# EAGLE design TRV2_0 (EAGLE 7.6.0)
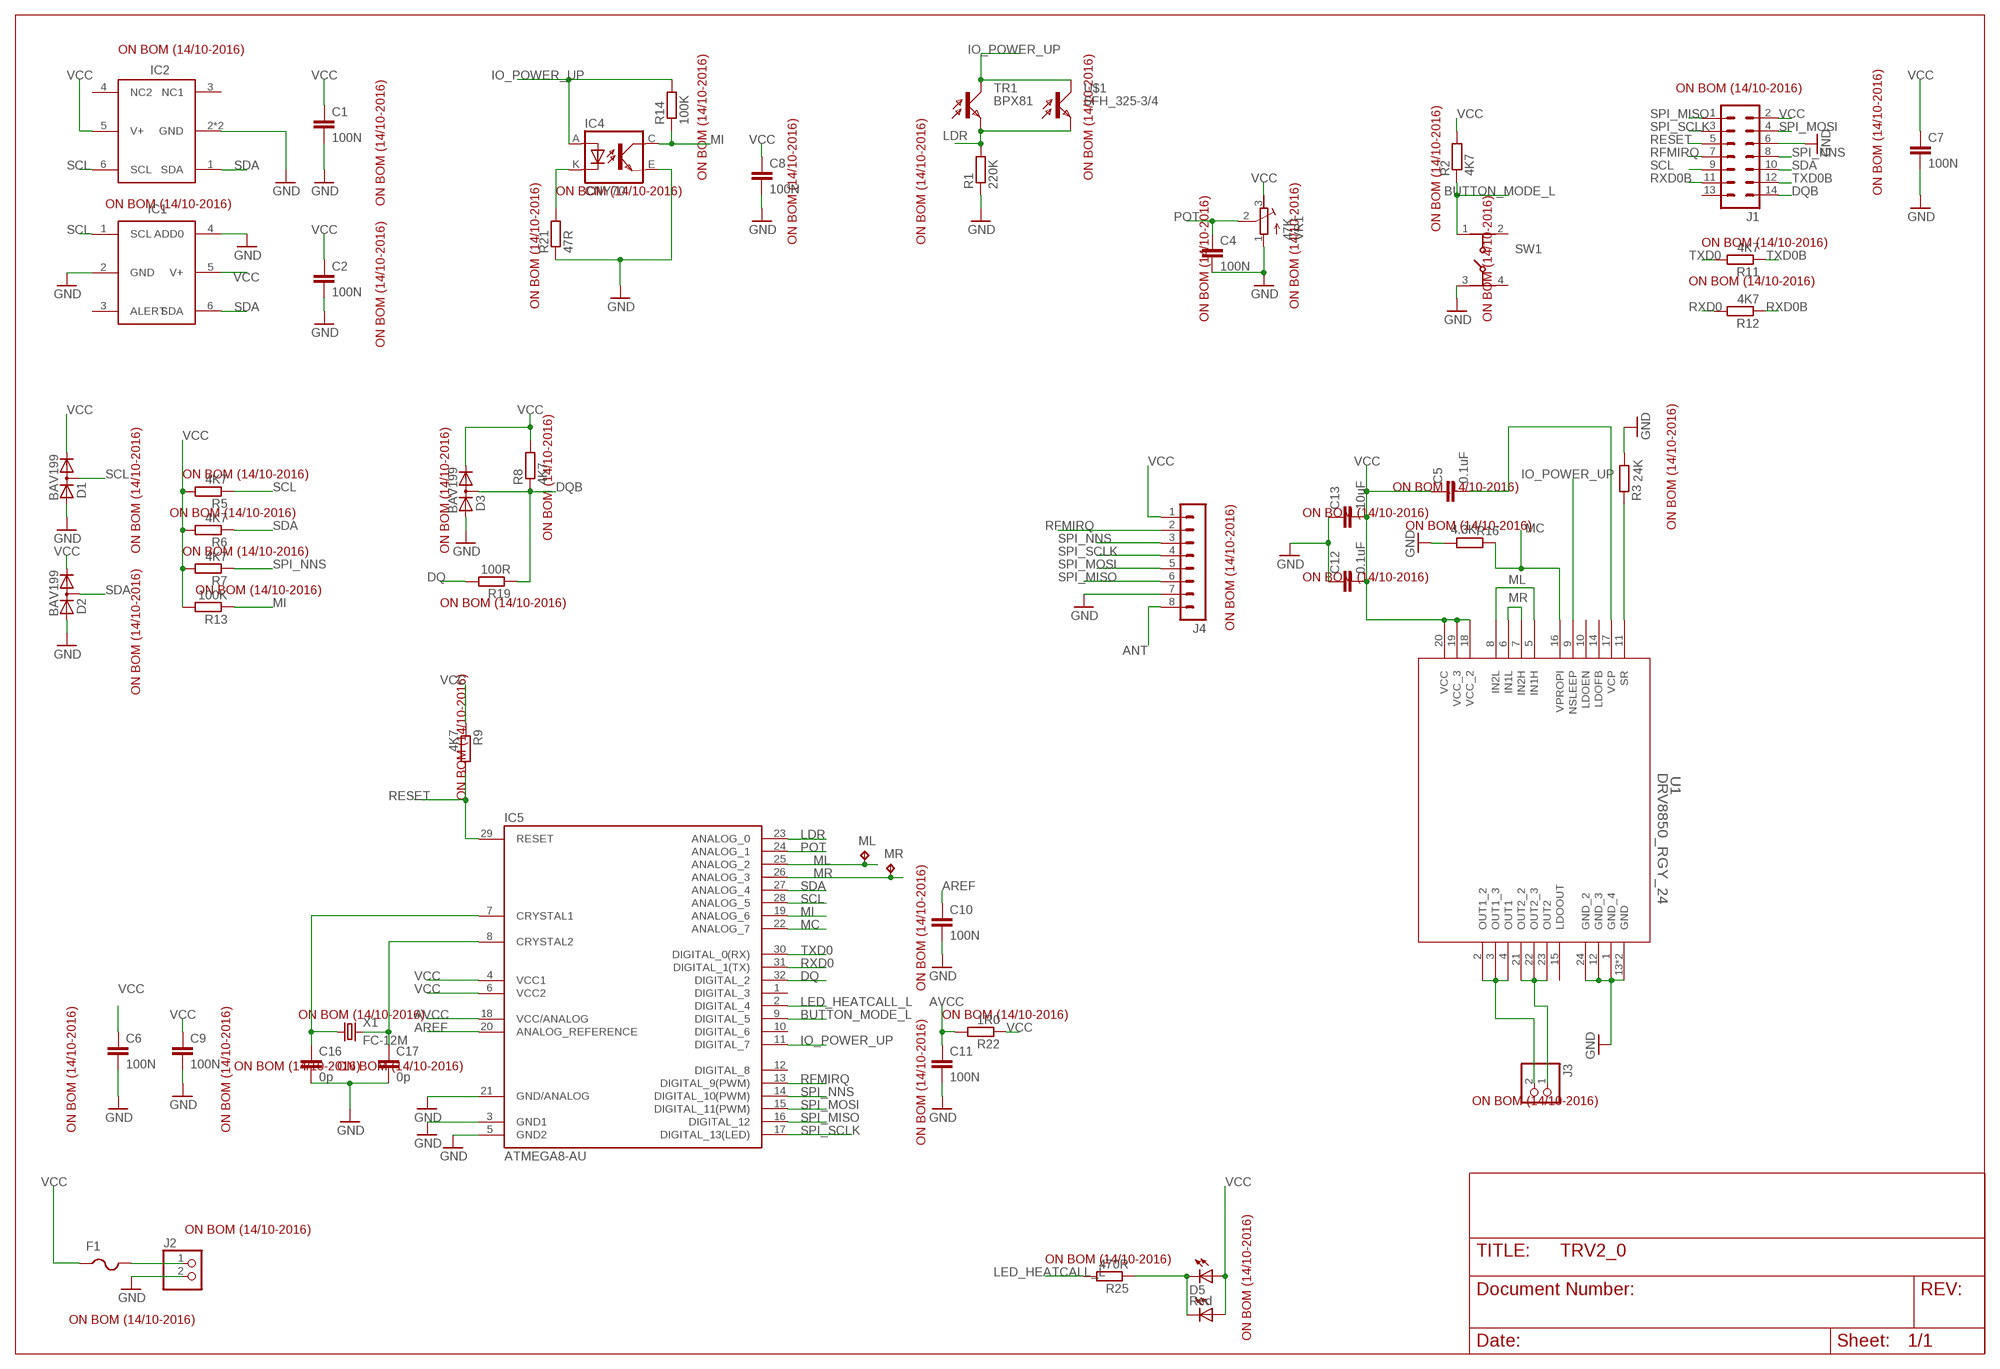
[diagram p0: schematic, sheet 1]

## Parts
C1  100N  C-EUC0603  [C0603]
C2  100N  C-EUC0603  [C0603]
C4  100N  C-EUC0603  [C0603]
C5  0.1uF  C-EUC0603  [C0603]
C6  100N  C-EUC0603  [C0603]
C7  100N  C-EUC0603  [C0603]
C8  100N  C-EUC0603  [C0603]
C9  100N  C-EUC0603  [C0603]
C10  100N  C-EUC0603  [C0603]
C11  100N  C-EUC0603  [C0603]
C12  0.1uF  C-EUC0603  [C0603]
C13  10uF  C-EUC0603  [C0603]
C16  0p  C-EUC0603  [C0603]
C17  0p  C-EUC0603  [C0603]
D1  BAV199  [SOT23]
D2  BAV199  [SOT23]
D3  BAV199  [SOT23]
D5  Red  LED3MM  [LED3MM]
F1  PTCFUSE-0603  [CHIPLED-0603-TTW]
IC1  TMP112  [TMP112]
IC2  IC2  SHT21  [SHT21]
IC4  CNY70  [4]
IC5  ATMEGA8-AU  [TQFP32-08]
J1  MA07-2  [MA07-2]
J2  PINHD-1X2  [1X02]
J3  PINHD-1X2  [1X02]
J4  MA08-1  [MA08-1]
ML  TPB1,27  [B1,27]
MR  TPB1,27  [B1,27]
R1  220K  R-EU_R0603  [R0603]
R2  4K7  R-EU_R0603  [R0603]
R3  24K  R-EU_R0603  [R0603]
R5  4K7  R-EU_R0603  [R0603]
R6  4K7  R-EU_R0603  [R0603]
R7  4K7  R-EU_R0603  [R0603]
R8  4K7  R-EU_R0603  [R0603]
R9  4K7  R-EU_R0603  [R0603]
R11  4K7  R-EU_R0603  [R0603]
R12  4K7  R-EU_R0603  [R0603]
R13  100K  R-EU_R0603  [R0603]
R14  100K  R-EU_R0603  [R0603]
R16  4.3K  R-EU_R0603  [R0603]
R19  100R  R-EU_R0603  [R0603]
R21  47R  R-EU_R0603  [R0603]
R22  1R0  R-EU_R0603  [R0603]
R25  470R  R-EU_R0603  [R0603]
SW1  434331013822  [434331013822]
TR1  BPX81  [BPX81]
U1  DRV8850_RGY_24  [RGY_24]
U$1  SFH_325-3/4  [SFH_325-3/4]
U$2  KINGBRIGHTSIDELED  [KINGBRIGHTSIDELED]
VR1  47K  R-TRIMM3296W  [RTRIM3296W]
X1  FC-12M  [FC-12M]

## Nets
ANT: J4.8
AREF: C10.1 IC5.20(ANALOG_REFERENCE)
AVCC: C11.1 IC5.18(VCC/ANALOG) R22.2
BUTTON_MODE_L: IC5.9(DIGITAL_5) R2.1 SW1.1
DQ: IC5.32(DIGITAL_2) R19.2
DQB: D3.3(AC) J1.14 R8.1 R19.1
GND: C1.2 C2.2 C4.2 C6.2 C7.2 C8.2 C9.2 C10.2 C11.2 C12.1 C13.1 C16.2 C17.2 D1.1(A) D2.1(A) D3.1(A) IC1.2(GND) IC1.4(ADD0) IC2.2(GND) IC2.P$1(GND) IC4.E(EMI) IC5.3(GND1) IC5.5(GND2) IC5.21(GND/ANALOG) J1.6 J2.2 J4.7 R1.1 R3.1 R16.1 R21.1 SW1.3 U1.1(GND_4) U1.12(GND_3) U1.13(GND) U1.24(GND_2) U1.25(GND) VR1.1(A)
IO_POWER_UP: IC4.A IC5.11(DIGITAL_7) R14.2 TR1.C U1.9(NSLEEP) U$1.P$2(C)
LDR: IC5.23(ANALOG_0) R1.2 TR1.E U$1.P$1(E)
LED_HEATCALL_L: IC5.2(DIGITAL_4) R25.2
MC: IC5.22(ANALOG_7) R16.2 U1.16(VPROPI)
MI: IC4.C(COL) IC5.19(ANALOG_6) R13.1 R14.1
ML: IC5.25(ANALOG_2) ML.TP U1.5(IN1H) U1.8(IN2L)
MR: IC5.26(ANALOG_3) MR.TP U1.6(IN1L) U1.7(IN2H)
N$1: IC4.K(C) R21.2
N$2: J3.2 U1.2(OUT1_2) U1.3(OUT1_3) U1.4(OUT1)
N$4: C16.1 IC5.7(CRYSTAL1) X1.1
N$5: C17.1 IC5.8(CRYSTAL2) X1.2
N$7: D5.K(C) R25.1 U$2.C
N$8: F1.C J2.1
N$11: J3.1 U1.21(OUT2_2) U1.22(OUT2_3) U1.23(OUT2)
N$12: R3.2 U1.11(SR)
N$20: C5.2 U1.17(VCP)
POT: C4.1 IC5.24(ANALOG_1) VR1.2(S)
RESET: IC5.29(RESET) J1.5 R9.2
RFMIRQ: IC5.13(DIGITAL_9(PWM)) J1.7 J4.2
RXD0: IC5.31(DIGITAL_1(TX)) R12.2
RXD0B: J1.11 R12.1
SCL: D1.3(AC) IC1.1(SCL) IC2.6(SCL) IC5.28(ANALOG_5) J1.9 R5.1
SDA: D2.3(AC) IC1.6(SDA) IC2.1(SDA) IC5.27(ANALOG_4) J1.10 R6.1
SPI_MISO: IC5.16(DIGITAL_12) J1.1 J4.6
SPI_MOSI: IC5.15(DIGITAL_11(PWM)) J1.4 J4.5
SPI_NNS: IC5.14(DIGITAL_10(PWM)) J1.8 J4.3 R7.1
SPI_SCLK: IC5.17(DIGITAL_13(LED)) J1.3 J4.4
TXD0: IC5.30(DIGITAL_0(RX)) R11.2
TXD0B: J1.12 R11.1
VCC: C1.1 C2.1 C5.1 C6.1 C7.1 C8.1 C9.1 C12.2 C13.2 D1.2(C) D2.2(C) D3.2(C) D5.A F1.A IC1.5(V+) IC2.5(V+) IC5.4(VCC1) IC5.6(VCC2) J1.2 J4.1 R2.2 R5.2 R6.2 R7.2 R8.2 R9.1 R13.2 R22.1 U1.18(VCC_2) U1.19(VCC_3) U1.20(VCC) U$2.A VR1.3(E)
Unconnected: IC1.3(ALERT) IC2.3(NC1) IC2.4(NC2) IC5.1(DIGITAL_3) IC5.10(DIGITAL_6) IC5.12(DIGITAL_8) J1.13 SW1.2 SW1.4 U1.10(LDOEN) U1.14(LDOFB) U1.15(LDOOUT)

## Notes on the sheet
- ON BOM (14/10-2016) | ON BOM (14/10-2016) | ON BOM (14/10-2016)
- IC2
- ON BOM (14/10-2016)
- ON BOM (14/10-2016)
- ON BOM (14/10-2016)
- ON BOM (14/10-2016) | ON BOM (14/10-2016)
- ON BOM (14/10-2016) | ON BOM (14/10-2016)
- ON BOM (14/10-2016) | ON BOM (14/10-2016) | ON BOM (14/10-2016) | ON BOM (14/10-2016)
- ON BOM (14/10-2016)
- IC1
- ON BOM (14/10-2016)
- ON BOM (14/10-2016)
- ON BOM (14/10-2016)
- ON BOM (14/10-2016)
- ON BOM (14/10-2016) | ON BOM (14/10-2016)
- ON BOM (14/10-2016)
- ON BOM (14/10-2016)
- ON BOM (14/10-2016)
- ON BOM (14/10-2016) | ON BOM (14/10-2016)
- ON BOM (14/10-2016) | ON BOM (14/10-2016)
- ON BOM (14/10-2016)
- ON BOM (14/10-2016)
- ON BOM (14/10-2016)
- ON BOM (14/10-2016)
- ON BOM (14/10-2016)
- ON BOM (14/10-2016)
- ON BOM (14/10-2016)
- ON BOM (14/10-2016) | ON BOM (14/10-2016)
- ON BOM (14/10-2016) | ON BOM (14/10-2016) | ON BOM (14/10-2016)
- ON BOM (14/10-2016) | ON BOM (14/10-2016)
- ON BOM (14/10-2016)
- ON BOM (14/10-2016)
- ON BOM (14/10-2016)
- ON BOM (14/10-2016)
- ON BOM (14/10-2016)

## Library data of the parts
C1 C2 C4 C6-C11 C16 C17 = rcl:C-EU: CAPACITOR, European symbol
C5 C12 C13 = resistor:C-EU: CAPACITOR, European symbol
D1-D3 = diode:BAV199: DIODE low-leakage double diode
D5 = adafruit:LED: LED OSRAM: - CHIPLED LG R971, LG N971, LY N971, LG Q971, LY Q971, LO R971, LY R971 LH N974, LH R974 LS Q976, LO Q976, LY Q976 LO Q996 - Hyper CHIPLED LW Q18S LB Q993, LB Q99A, LB R99A - SideLED LS A670, LO A670, LY A670, LG A670, LP A670 LB A673, LV A673, LT A673, LW A673 LH A674 LY A675 LS A676, LA A676, LO A676, LY A676, LW A676 LS A679, LY A679, LG A679 - Hyper Micro SIDELED® LS Y876, LA Y876, LO Y876, LY Y876 LT Y87S - SmartLED LW L88C, LW L88S LB L89C, LB L89S, LG L890 LS L89K, LO L89K, LY L89K LS L896, LA L896, LO L896, LY L896 - TOPLED LS T670, LO T670, LY T670, LG T670, LP T670 LSG T670, LSP T670, LSY T670, LOP T670, LYG T670 LG T671, LOG T671, LSG T671 LB T673, LV T673, LT T673, LW T673 LH T674 LS T676, LA T676, LO T676, LY T676, LB T676, LH T676, LSB T676, LW T676 LB T67C, LV T67C, LT T67C, LS T67K, LO T67K, LY T67K, LW E67C LS E67B, LA E67B, LO E67B, LY E67B, LB E67C, LV E67C, LT E67C LW T67C LS T679, LY T679, LG T679 LS T770, LO T770, LY T770, LG T770, LP T770 LB T773, LV T773, LT T773, LW T773 LH T774 LS E675, LA E675, LY E675, LS T675 LS T776, LA T776, LO T776, LY T776, LB T776 LHGB T686 LT T68C, LB T68C - Hyper Mini TOPLED® LB M676 - Mini TOPLED Santana® LG M470 LS M47K, LO M47K, LY M47K Source: http://www.osram.convergy.de/
F1 = adafruit:PTCFUSE: PTC fuses, resettable thermistors
IC1 = TMP112:TMP112
IC2 = SHT21:SHT21: Tempsensor RS No: 709-8868 MRF No: TMP112AIDRLT
IC4 = cny70:CNY70
IC5 = Arduino-AVR:ATMEGA8
J1 = con-lstb:MA07-2: PIN HEADER; OC_FARNELL: unknown; OC_NEWARK: unknown
J2 J3 = pinhead:PINHD-1X2: PIN HEADER
J4 = con-lstb:MA08-1: PIN HEADER; OC_FARNELL: unknown; OC_NEWARK: unknown
ML MR = testpad:TP: Test pad
R1-R3 R5-R9 R11-R14 R16 R19 R21 R22 R25 = resistor:R-EU_: RESISTOR, European symbol
SW1 = EAGLE-TACT_SWITCHES-rev16e:434331013822: WS-TASU Side push Tact Switch, SMD version Specification Rating : 50mA, 12VDC Contact Resistance Initial: 100mΩ max. After life test:1mΩ max. Insulation Resistance: min.100MΩ at 500VDC Dielectric Strength : 250VAC for 1 minute Stroke:0.2+0.2/-0.1mm Bounce :10ms max. Material Cover : : Stainless steel Stem :PA46 UL HB. FramePA46 UL HB, color Black >Contact : Stainless Steel with Silver Tape:Polyimide tape Terminal : Copper Alloy with Silver <http://katalog.we-online.de/media/images/v2/Family_WS-TASU_434331013822_c.jpg> Details see: http://katalog.we-online.de/em/datasheet/434331013822.pdf 2015 (C) Würth Elektronik
TR1 = opto-trans-siemens:BPX81: PHOTO TRANSISTOR; OC_FARNELL: unknown; OC_NEWARK: unknown
U1 = drv8850:DRV8850_RGY_24; MANUFACTURER_PART_NUMBER: drv8850_rgy_24; VENDOR: Texas Instruments
U$1 = opto-trans-siemens:SFH_325-3/4
U$2 = led:KINGBRIGHTSIDELED
VR1 = resistor:R-TRIMM: Trimm resistor
X1 = crystal:FC-12M: kHz RANGE CRYSTAL UNIT LOW PROFILE SMD Source: Epson Toyocom FC-12M.pdf

## Net classes
0 default: width 0 mm

## Board
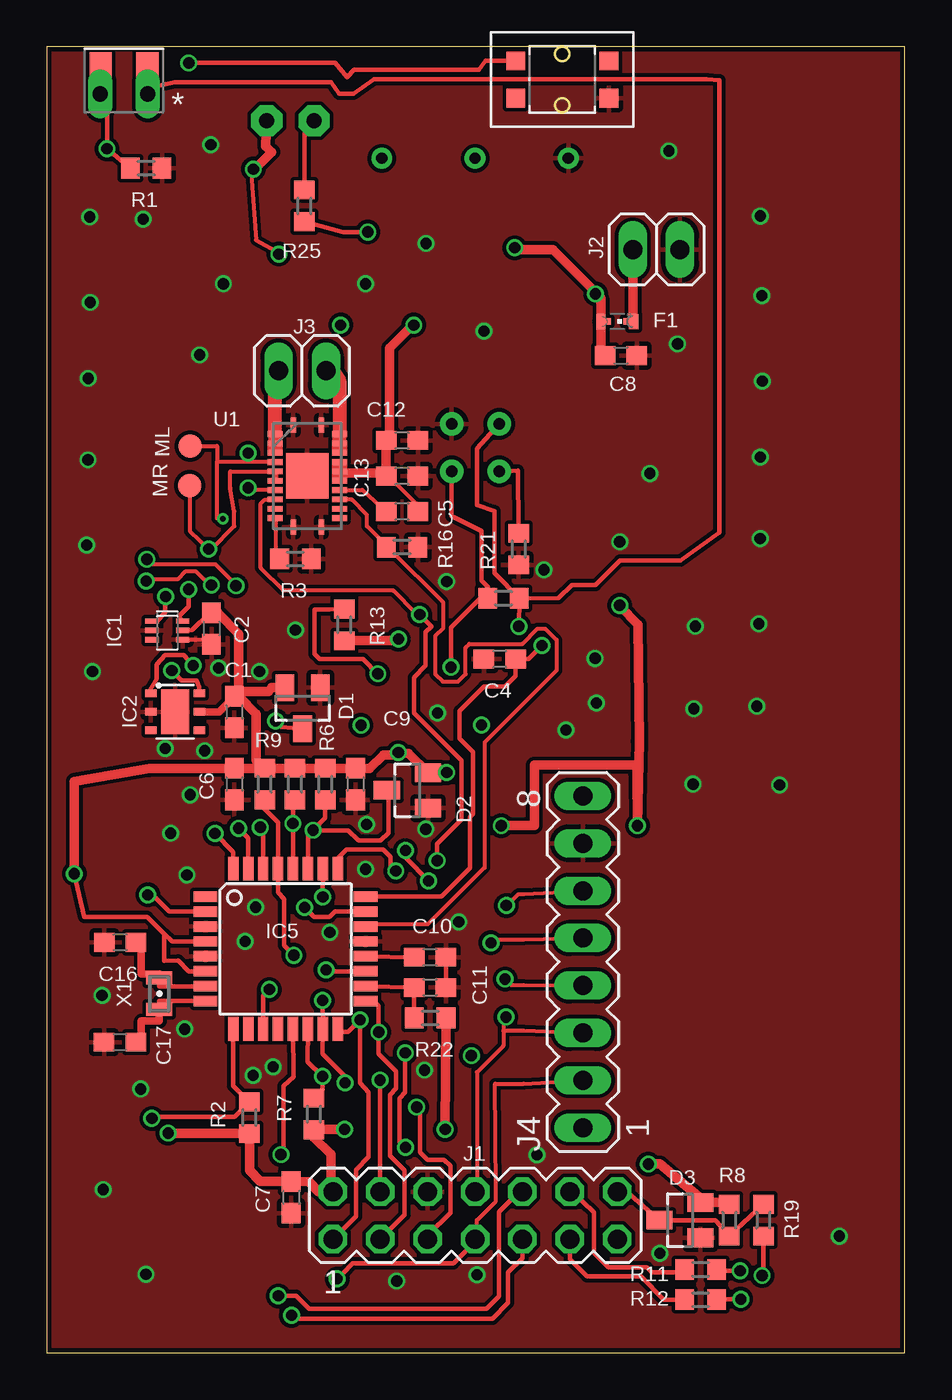
[diagram p1: board, top side]
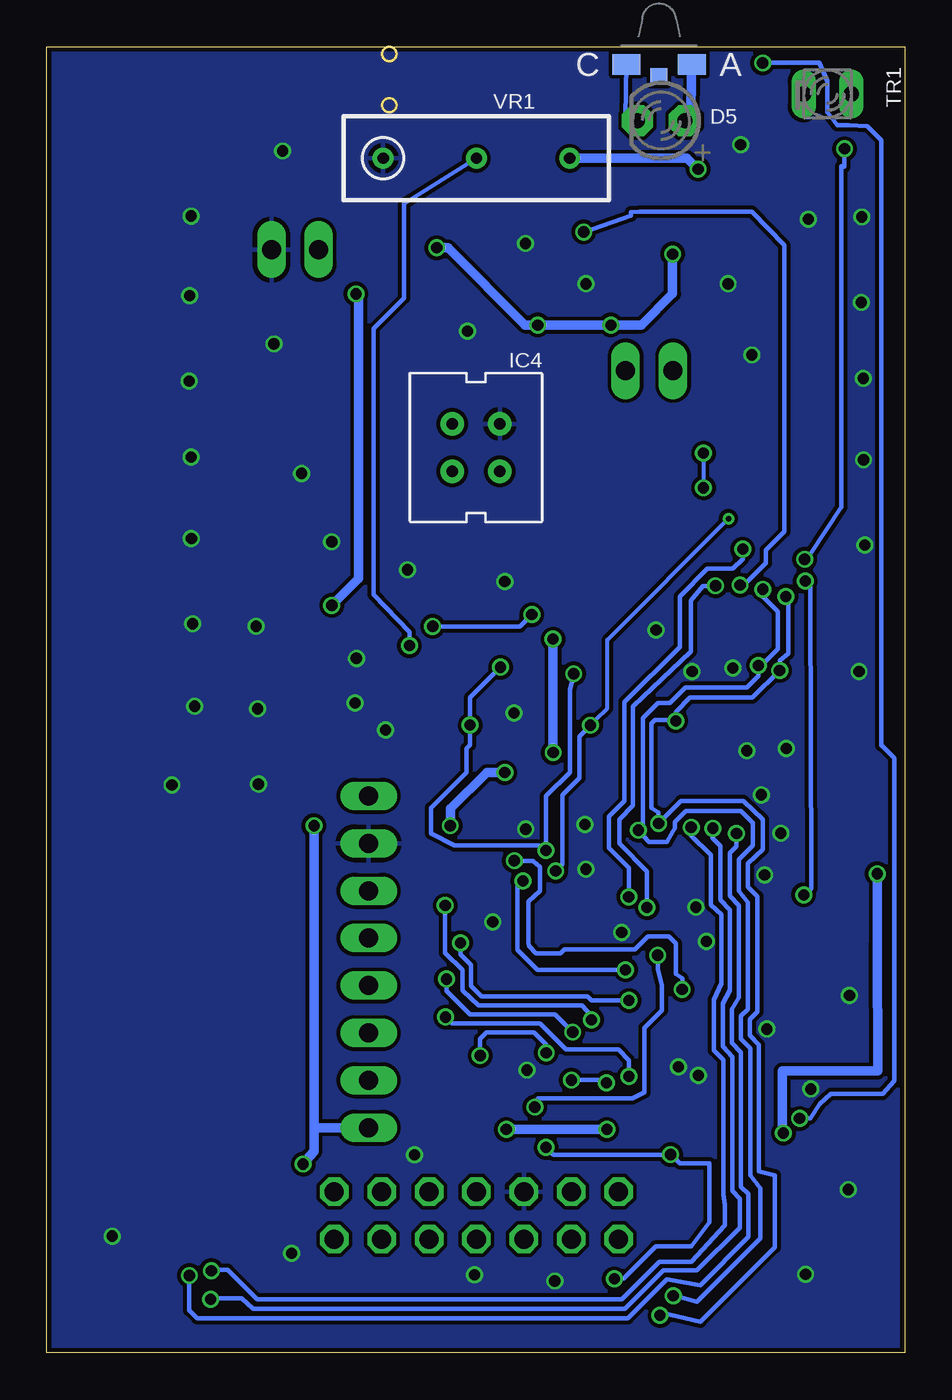
[diagram p2: board, bottom side, seen from below]

Size 46 x 70 mm. Coordinates in mm from the lower left corner, seen from the top.
Outline: 0,0 46,0 46,70 0,70 0,0
Copper layers (1*16): Top 0.035mm / dielectric 1.5mm / Bottom 0.035mm
Design rules "PMServicesStd": minimum track width 8mil, minimum drill 12mil, track to track 8mil, track to pad 8mil, pad to pad 8mil, via to via 8mil, smd to smd 0mil, copper to edge 10mil, drill to drill 10mil, minimum pad ring 10mil, minimum via ring 6mil, stop-mask expansion 2mil, vias tented up to drill 100mil, thermal gap 10mil

### Footprints (pad centres in the part's own frame; a part is rotated, then mirrored left to right if it is on the bottom)
C0603 = smd 1.1 x 1: 1 -0.85,0; 2 0.85,0
SOT23 = smd 1 x 1.4: 1 -0.95,-1.1; 2 0.95,-1.1; 3 0,1.1
LED3MM = drill 0.813 pad 1.676 octagon: A -1.27,0; K 1.27,0
CHIPLED-0603-TTW = smd 0.8 x 0.5: A 0,-0.875; C 0,0.875 | smd 0.35 x 0.35: A@1 0,-0.5; C@1 0,0.5
TMP112 = smd 0.285 x 0.7: 1 -0.5,-0.825; 2 0,-0.825; 3 0.5,-0.825; 4 0.5,0.825; 5 0,0.825; 6 -0.5,0.825
SHT21 = smd 0.4 x 0.6: 1 -1,-1.3; 2 0,-1.3; 3 1,-1.3; 4 1,1.3; 5 0,1.3; 6 -1,1.3 | smd 2.4 x 1.5: P$1 0,0
4 = drill 0.61 pad 1.27: A -1.27,1.27; C 1.27,-1.27; E 1.27,1.27; K -1.27,-1.27
TQFP32-08 = smd 1.27 x 0.559: 1 -4.293,2.8; 2 -4.293,2; 3 -4.293,1.2; 4 -4.293,0.4; 5 -4.293,-0.4; 6 -4.293,-1.2; 7 -4.293,-2; 8 -4.293,-2.8; 17 4.293,-2.8; 18 4.293,-2; 19 4.293,-1.2; 20 4.293,-0.4; 21 4.293,0.4; 22 4.293,1.2; 23 4.293,2; 24 4.293,2.8 | smd 0.559 x 1.27: 9 -2.8,-4.293; 10 -2,-4.293; 11 -1.2,-4.293; 12 -0.4,-4.293; 13 0.4,-4.293; 14 1.2,-4.293; 15 2,-4.293; 16 2.8,-4.293; 25 2.8,4.293; 26 2,4.293; 27 1.2,4.293; 28 0.4,4.293; 29 -0.4,4.293; 30 -1.2,4.293; 31 -2,4.293; 32 -2.8,4.293
MA07-2 = drill 1.016 octagon: 1 -7.62,-1.27; 2 -7.62,1.27; 3 -5.08,-1.27; 4 -5.08,1.27; 5 -2.54,-1.27; 6 -2.54,1.27; 7 0,-1.27; 8 0,1.27; 9 2.54,-1.27; 10 2.54,1.27; 11 5.08,-1.27; 12 5.08,1.27; 13 7.62,-1.27; 14 7.62,1.27
1X02 = drill 1.016 long: 1 -1.27,0; 2 1.27,0
MA08-1 = drill 1.016 long: 1 -8.89,0; 2 -6.35,0; 3 -3.81,0; 4 -1.27,0; 5 1.27,0; 6 3.81,0; 7 6.35,0; 8 8.89,0
B1,27 = smd 1.27 x 1.27: TP 0,0
R0603 = smd 1 x 1.1: 1 -0.85,0; 2 0.85,0
434331013822 = smd 1 x 1: 1 -2.5,1; 2 2.5,1; 3 2.5,-1; 4 -2.5,-1
BPX81 = drill 0.813 long: C 1.27,0; E -1.27,0
RGY_24 = smd 0.305 x 0.805: 1 -0.75,2.727; 12 -0.75,-2.727; 13 0.75,-2.727; 24 0.75,2.727 | smd 0.805 x 0.305: 2 -1.727,2.25; 3 -1.727,1.75; 4 -1.727,1.25; 5 -1.727,0.75; 6 -1.727,0.25; 7 -1.727,-0.25; 8 -1.727,-0.75; 9 -1.727,-1.25; 10 -1.727,-1.75; 11 -1.727,-2.25; 14 1.727,-2.25; 15 1.727,-1.75; 16 1.727,-1.25; 17 1.727,-0.75; 18 1.727,-0.25; 19 1.727,0.25; 20 1.727,0.75; 21 1.727,1.25; 22 1.727,1.75; 23 1.727,2.25 | smd 2.26 x 2.44: 25 0,0
SFH_325-3/4 = smd 1.2 x 3: P$1 -1.25,0; P$2 1.25,0
KINGBRIGHTSIDELED = smd 1.5 x 1.1: A 1.75,0; C -1.75,0 | smd 0.9 x 0.9: NC 0,-0.65
RTRIM3296W = drill 0.61: 1 0,-5; 2 0,0; 3 0,5
FC-12M = smd 0.7 x 1.4: 1 -0.85,0; 2 0.85,0

### Placement (x,y rotation side)
C1  10.06,34.34 270 top
C2  8.84,38.81 270 top
C4  24.28,37.19 180 top
C5  19.05,45.09 180 top
C6  10.06,30.48 270 top
C7  13.11,8.33 270 top
C8  30.78,53.44 0 top
C9  16.56,30.48 270 top
C10  20.55,21.2 0 top
C11  20.55,19.58 0 top
C12  19.05,48.9 180 top
C13  19.05,46.99 180 top
C16  3.94,22 180 top
C17  3.92,16.65 180 top
D1  13.72,34.54 180 top
D2  19.34,30.14 90 top
D3  33.95,7.11 90 top
D5  13.07,66.03 180 bottom
F1  30.58,55.27 270 top
IC1  6.47,38.72 270 top
IC2  6.88,34.36 270 top
IC4  22.98,48.51 0 bottom
IC5  12.8,21.65 0 top
J1  22.96,7.37 0 top
J2  32.68,59.13 0 top
J3  13.7,52.63 180 top
J4  28.74,20.95 90 top
ML  7.7,48.6 0 top
MR  7.68,46.48 0 top
R1  5.33,63.49 180 top
R2  10.87,12.6 270 top
R3  13.34,42.55 180 top
R5  13.31,30.48 90 top
R6  14.94,30.48 90 top
R7  14.33,12.8 270 top
R8  36.59,7.11 90 top
R9  11.68,30.48 270 top
R11  35.05,4.47 0 top
R12  35.05,2.84 0 top
R13  15.95,39.01 270 top
R14  24.49,40.44 0 top
R16  19.05,43.18 180 top
R19  38.42,7.11 270 top
R21  25.3,43.08 90 top
R22  20.55,17.95 180 top
R25  13.82,61.47 270 top
SW1  27.64,68.24 0 top
TR1  4.15,67.46 180 bottom
U1  13.97,46.99 0 top
U$1  4.15,68.2 0 top
U$2  13.18,69.06 0 bottom
VR1  22.96,64.02 270 bottom
X1  6.04,19.25 270 top

### Tracks (layer width: path | path; a pad name or v marks a point on that pad's centre or on a via)
AREF
  Top 0.254: C10.1 IC5.20
AVCC
  Top 0.254: IC5.18 C11.1 R22.2
BUTTON_MODE_L  (via drill 0.6)
  Top 0.254: IC5.9 10,14.29 R2.1 10.07,12.63 5.71,12.63 v5.64,12.56 | SW1.1 23.52,69.24 23.17,68.76 16.49,68.76 16.1,68.37 15.45,69.12 v7.62,69.12
  Bottom 0.254: v7.62,69.12 4.58,69.12 4.17,68.15 4.17,66.47 3.63,65.78 3.01,65.78 2.01,65.73 1.27,64.99 1.27,32.55 1.24,32.55 0.58,31.88 0.58,14.57 1.18,13.89 3.97,13.89 4.55,13.34 5.08,12.56 v5.64,12.56
DQ  (via drill 0.6)
  Top 0.254: v9.02,27.83 10,26.86 IC5.32 | R19.2 38.42,4.07 v38.35,4.14
  Bottom 0.254: v38.35,4.14 38.36,3.81 38.36,2.29 37.94,1.86 14.84,1.86 12.75,3.95 10.97,3.63 8.39,6.21 8.39,8.51 8.78,8.89 8.78,16.11 9.28,16.61 9.28,18.41 8.89,19.05 8.89,23.99 9.38,24.48 9.38,26.8 9.04,27.15 v9.02,27.83
DQB
  Top 0.254: R19.1 R8.1 35.84,7.11 D3.3 31.11,8.64 J1.14
GND  (via drill 0.6)
  Top 0.203: IC1.4 8.84,38.22
  Top 0.254: C11.2 C10.2
  Top 0.406: 8.84,38.22 C2.2
  other vias: 20.95,34.29 17.14,28.32 32.88,5.33 6.35,32.38 13.34,38.73 27.84,33.39 20.32,28.07 38.26,60.93 38.34,56.66 38.36,52.08 33.82,54.07 38.25,48.01 38.25,43.64 38.18,39.07 34.78,38.94 30.72,43.46 26.65,41.96 29.4,37.22 29.46,34.83 34.69,34.52 38.07,34.65 34.65,30.48 39.28,30.44 42.49,6.26 26.27,10.62 23.07,4.18 18.76,3.85 2.45,36.51 3.04,8.75 5.32,4.21 5.04,14.14 12.13,15.33 11.07,14.88 10.63,22.06 11.21,23.88 17.09,25.92 15.18,22.53 22.09,23.09 7.69,29.91 6.65,27.85 7.52,25.61 7.4,17.35 20.26,15.15 8.46,32.27 9.22,36.69 21.44,41.34 11.41,36.51 9.47,57.29 20.34,59.46 8.8,64.75 5.17,60.76 33.36,64.41 2.31,60.88 2.33,56.3 2.22,52.22 2.21,47.86 2.15,43.29 2.97,19.16 8.2,53.48 17.09,57.29 23.44,54.75 32.33,47.13
  pour Top: 0,70 0,0 46,0 46,70
  pour Bottom: 0,70 0,0 46,0 46,70
IO_POWER_UP  (via drill 0.6)
  Top 0.203: U1.9 12.09,45.72 11.68,45.72 11.48,45.52 11.48,42.06 12.7,40.84 18.59,40.84 19.81,39.62 v20,39.56 | U$1.P$2 5.49,68.28 5.49,67.46 TR1.C
  Top 0.254: IC5.11 11.6,19.14 v11.94,19.48 | IC4.A 23.05,48.46 23.05,45.42 24.01,45.11 24.01,41.8 R14.2 | v25.31,38.93 R14.2 | R14.2 27.44,40.44 28.16,41.16 29.42,41.16 30.72,42.46 33.98,42.46 36.06,43.97 36.06,68.19 35.4,68.25 17.55,68.25 16.45,67.47 15.69,67.47 15.24,68.1 6.85,68.1 5.42,67.77 TR1.C | v20.93,26.37 20.93,27.28 22.23,28.57 22.23,31.75 19.68,34.29 19.68,36.2 20.32,36.83 20.32,38.63 20.62,38.93 v20,39.56
  Bottom 0.254: v20,39.56 20.62,38.93 v25.31,38.93 | v11.94,19.48 11.94,20.06 12.28,20.32 12.28,21.94 12.66,22.32 13.77,22.32 14.46,21.63 18.25,21.63 18.46,21.42 19.78,21.42 20.16,21.8 20.16,21.96 20.16,24.2 19.55,24.77 19.55,26.04 19.93,26.37 v20.93,26.37
LDR  (via drill 0.6)
  Top 0.203: v10.15,41.11 10.06,41.25 9.04,42.27 5.59,42.27 5.38,42.47 v5.37,42.52
  Top 0.254: v13.82,23.87 14.34,23.35 15.17,23.35 15.47,23.65 16.94,23.65 IC5.23 | U$1.P$1 TR1.E 3.23,67.11 v3.23,64.53 R1.2
  Bottom 0.254: v10.15,41.11 10.83,41.11 11.46,40.32 11.46,37.59 14.58,34.63 14.58,29.34 15.3,28.57 15.3,27.3 13.82,25.8 v13.82,23.87 | v5.37,42.52 5.08,42.82 3.41,45.34 3.41,63.59 3.24,63.58 v3.23,64.53
LED_HEATCALL_L  (via drill 0.6)
  Top 0.203: v5.34,41.36 5.38,41.45 7.01,41.45 7.42,41.86 8.03,41.86 8.64,41.25 v8.83,41.14
  Top 0.254: IC5.2 6.56,23.65 5.67,24.54 v5.42,24.55 | v17.21,60.07 15.88,60.07 R25.2
  Bottom 0.254: v17.21,60.07 14.68,60.95 14.68,61.12 14.22,61.15 8.21,61.15 6.47,59.37 6.47,44 7.46,43.02 7.46,42.32 8.64,41.14 v8.83,41.14 | v5.42,24.55 5.3,24.55 5.01,24.88 5.01,25.4 5.08,40.64 5.08,41.1 v5.34,41.36
MC
  Top 0.203: U1.16 15.75,45.72 16.36,45.72 17.17,44.91 17.17,44.3 18.19,43.28 R16.2 18.39,43.08 21.23,40.23 21.23,38.81 20.83,38.41 20.83,36.37 21.23,35.97 22.05,35.97 22.45,36.37 22.45,37.8 22.66,38 25.5,38 26.31,38.81 26.72,38.81 27.33,38.2 27.33,36.58 23.47,32.72 23.47,26.01 20.42,22.96 17.17,22.96 IC5.22
MI  (via drill 0.6)
  Top 0.254: IC5.19 15.05,20.45 v14.97,20.53 | IC4.C 21.71,44.84 23.32,44.04 23.32,41.4 23.66,41.05 R14.1 23.24,40.44 21.67,38.87 v21.67,36.75 | v20.47,25.29 19.24,26.54 v19.23,26.92 | 14.63,37.19 16.95,37.19 v17.75,36.39 | R13.1 15.18,39.84 14.61,39.84 14.59,39.83 14.36,39.83 14.36,37.46 14.63,37.19 | v17.75,36.39 | 14.63,37.19
  Bottom 0.254: v21.67,36.75 23.31,35.11 v23.31,33.64 23.31,32.57 23.5,32.38 23.5,31.11 25.4,29.21 25.4,27.84 24.13,27.2 19.62,27.2 v19.23,26.92 19.23,29.84 17.94,31.11 17.94,35.56 v17.75,36.39 | v20.47,25.29 20.47,25.25 20.77,24.99 20.77,21.59 19.68,20.53 v14.97,20.53
ML  (via drill 0.3, 0.6)
  Top 0.203: 9.13,47.75 9.13,44.72 v9.45,44.7 | 9.13,47.75 10.79,47.75 | 10.79,47.75 11.89,47.75 U1.5 10.79,47.75 | U1.8 10.91,46.24 v10.79,46.35 | 10.79,47.75 v10.79,48.22 | ML.TP 9.13,48.6 9.13,47.75
  Top 0.254: v18.71,25.82 18.43,26.04 18.43,26.58 18.04,26.98 16.07,26.98 15.6,26.5 IC5.25 | U1.5 11.95,47.74
  Bottom 0.203: v9.45,44.7 15.95,38.2 15.95,34.54 16.56,33.93 16.76,33.93 16.97,33.73 v16.85,33.64 | v10.79,48.22 v10.79,46.35
  Bottom 0.254: v16.85,33.64 17.45,33.03 17.45,30.8 18.37,29.89 18.37,26.17 v18.71,25.83 v18.71,25.82
MR  (via drill 0.6)
  Top 0.203: 12.09,46.74 U1.7 12.29,46.74 12.29,47.14 U1.6 9.84,47.24 9.84,46.35 10.06,45.11 10.06,44.3 8.84,43.08 v8.69,43.07 7.67,44.05 MR.TP
  Top 0.254: IC5.26 v14.8,24.43
  Top 0.406: MR.TP
  Bottom 0.254: v8.69,43.07 8.69,42.55 9.21,42.02 10.59,42.02 12.06,40.54 12.06,37.83 15.04,34.87 15.04,29.58 15.88,28.75 15.88,27.05 14.8,25.98 14.8,24.88 v14.8,24.43
N$1
  Top 0.254: IC4.K 25.26,47.28 25.29,44.11 R21.2
N$2
  Top 0.254: U1.4 U1.3
  Top 0.762: U1.3 U1.2 12.24,52.45 J3.2
N$4
  Top 0.254: IC5.7 6.04,19.65 X1.1
  Top 0.406: C16.1 5.08,22 5.08,20.32 6.04,20.32 X1.1
N$5
  Top 0.254: IC5.8 6.04,18.85 X1.2
  Top 0.406: C17.1 5.08,16.65 5.08,17.78 6.04,17.78 X1.2
N$7
  Top 0.254: R25.1 13.81,65.01 13.81,65.36 D5.K
  Bottom 0.254: U$2.C 14.97,66.25 D5.K
N$8
  Top 0.5: J2.1 31.41,55.24 F1.C
N$11
  Top 0.279: U1.21 U1.22
  Top 0.762: J3.1 15.32,52.63 15.7,52.07 U1.23 U1.22
N$12
  Top 0.203: U1.11 12.29,44.7 12.29,42.67 R3.2
N$20
  Top 0.203: U1.17 16.93,46.24 C5.2
POT  (via drill 0.6)
  Top 0.254: v26.55,37.9 25.84,37.19 C4.1 25.13,36.26 24.56,35.72 23.45,35.72 22.14,34.41 22.14,32.91 22.86,32.2 22.86,28.87 22.7,28.72 22.7,25.98 21.17,24.45 IC5.24
  Bottom 0.254: VR1.2 26.83,61.58 26.83,56.52 28.48,54.88 28.48,40.64 26.55,38.62 v26.55,37.9
RESET  (via drill 0.6)
  Top 0.254: v19.84,13.17 20.02,12.98 20.02,10.75 20.42,10.36 21.31,10.36 21.64,10.02 21.64,7.51 20.42,6.29 J1.5 | R9.2 11.68,29.14 12.4,28.42 IC5.29 12.4,24.66 12.73,24.33 12.73,21.83 v13.25,21.31
  Bottom 0.254: v13.25,21.31 13.25,20.55 13.02,19.7 13.02,18.35 13.97,17.4 13.97,13.97 14.61,13.64 19.67,13.64 v19.84,13.17
RFMIRQ  (via drill 0.6)
  Top 0.203: J4.2 25.56,14.43 24.04,14.43 24.08,8.74 24.08,8.13 23.06,7.11 23.06,6.1 J1.7
  Top 0.254: J1.7 22.96,5.95 21.8,4.8 16.41,4.8 15.88,4.27 v15.57,3.96 | IC5.13 13.23,14.8 12.7,14.3 12.7,10.73 v12.56,10.62 | v19.22,16.08 19.22,13.95 18.92,13.64 18.92,11.28 v19.23,11.01
  Bottom 0.254: 18.85,10.62 v12.56,10.62 12.53,10.62 12.06,10.16 10.48,10.16 10.48,6.99 11.43,5.71 13.34,5.71 15.09,3.96 v15.57,3.96 | 18.85,10.62 19.05,10.79 | 18.85,10.62 v19.23,11.01 | v19.22,16.08 19.22,16.51 19.89,17.17 22.43,17.17 22.76,16.84 v22.76,15.93
RXD0  (via drill 0.6)
  Top 0.254: IC5.31 10.79,27.6 v10.29,28.11 | v37.2,2.87 35.93,2.87 R12.2
  Bottom 0.203: v37.2,2.87 37.29,2.85 37.22,2.92
  Bottom 0.254: 37.22,2.92 35.54,2.92 34.92,2.36 15,2.36 12.94,4.42 11.15,4.42 8.85,6.71 8.85,8.26 9.25,8.68 9.25,15.88 9.76,16.41 9.76,18.73 9.37,19.43 9.37,23.73 9.9,24.26 9.9,27.18 10.31,27.58 v10.29,28.11
RXD0B
  Top 0.254: R12.1 33.08,2.85 31.84,4.09 28.95,4.09 28.04,5 28.04,5.99 J1.11
SCL  (via drill 0.6)
  Top 0.254: J1.9 25.5,5.08 24.73,4.31 24.73,2.68 23.89,1.84 13.3,1.84 v13.12,2.01 | IC5.28 v13.2,28.38 13.2,29.21 R5.1 | D1.3 12.61,33.53 v12.27,33.87 | IC2.6 8.19,35.69 8.05,36.02 7.25,36.02 v6.71,36.57 | v6.38,40.53 6.35,39.67 5.93,39.22 IC1.1
  Bottom 0.203: v12.27,33.87 12.29,33.93 12.29,33.91
  Bottom 0.254: v6.38,40.53 6.25,40.51 6.25,37.47 6.71,37.1 v6.71,36.57 8.17,35.11 11.52,35.11 12.27,34.35 v12.27,33.87 | v13.12,2.01 13.02,2.15 10.95,1.67 6.96,5.65 6.96,9.53 7.82,9.74 7.82,16.51 8.31,17.02 8.31,17.86 7.91,18.27 7.91,24.46 8.41,24.97 8.41,26.22 7.62,26.98 7.62,28.57 8.64,29.57 12.01,29.57 v13.2,28.38 13.22,28.57 13.22,28.97 13.57,29.21 13.57,33.73 13.39,33.91 12.29,33.91
SDA  (via drill 0.6)
  Top 0.254: v12.42,3.06 13.37,3.06 14.06,2.37 23.57,2.37 24.24,3.03 24.24,7.57 25.31,8.64 J1.10 | IC5.27 14,27.94 v14.27,28.01 | v14.27,28.01 14.93,28.67 R6.1 | D2.3 18.32,29.84 18.32,27.87 17.91,27.46 16.71,27.46 16.16,28.01 v14.27,28.01 | v7.85,36.84 7.36,37.4 6.35,37.4 5.9,36.88 5.9,36.1 5.58,35.58 IC2.1 | v7.61,40.92 7.62,39.99 7.14,39.52 7.14,39.37 IC1.6
  Bottom 0.254: v7.61,40.92 7.62,40.91 7.62,40.54 6.8,39.73 6.8,37.73 7.68,36.84 v7.85,36.84 7.85,36.27 8.48,35.65 11.78,35.65 12.6,34.83 13.25,34.83 14.05,34.03 14.05,28.31 v14.27,28.01 13.71,27.39 12.75,27.39 12.31,28.14 12.31,28.46 11.72,29.05 8.8,29.05 8.14,28.4 8.14,27.18 8.89,26.43 8.89,24.77 8.41,24.13 8.41,18.41 8.8,18.05 8.8,16.81 8.29,16.31 8.29,9.51 7.75,8.8 7.75,6.14 11.16,2.73 12.29,3.05 v12.42,3.06
SPI_MISO  (via drill 0.6)
  Top 0.203: J4.6 25.56,24.59 25.3,24.59 24.69,23.98 v24.64,23.97
  Top 0.254: IC5.16 15.6,17.2 16.15,17.2 v16.8,17.85 16.8,14.46 17.26,13.97 17.26,10.5 16.58,9.82 16.58,7.3 J1.1
  Bottom 0.254: v16.8,17.85 16.8,18.07 17.3,18.61 22.86,18.61 23.72,19.43 23.72,20.51 24.64,21.43 v24.64,23.97
SPI_MOSI  (via drill 0.6)
  Top 0.203: J4.5 25.56,22.15 23.88,22.15 v23.81,21.98
  Top 0.254: J1.4 v17.88,14.62 | v16,14.48 16,14.82 14.8,16.02 IC5.15 v14.78,18.89
  Bottom 0.203: v17.88,14.62 17.98,14.63 v17.88,14.62
  Bottom 0.254: v23.81,21.98 23.81,21.34 23.25,20.78 23.25,19.66 22.7,19.11 17.02,19.11 16.8,18.89 v14.78,18.89 | v16,14.48 16.14,14.62 v17.88,14.62
SPI_NNS  (via drill 0.6)
  Top 0.203: 24.49,17.27 24.49,17.88 v24.61,18 | 24.49,17.27 24.49,16.46 23.06,15.04 23.06,8.74 J1.8 | 24.49,17.27 25.56,17.27 J4.3
  Top 0.254: IC5.14 14,15.6 v14.79,14.81 14.78,14.09 R7.1
  Bottom 0.254: v14.79,14.81 14.79,15.67 15.37,16.25 18.17,16.25 19.57,17.65 24.27,17.65 v24.61,18
SPI_SCLK  (via drill 0.6)
  Top 0.203: J4.4 25.56,19.71 24.89,19.71 24.69,19.91 v24.57,20.03
  Top 0.254: IC5.17 17.55,18.85 17.8,18.6 v17.8,17.18 17.8,16.01 18.73,15.09 18.73,14.16 18.39,13.83 18.39,10.55 19.17,9.78 19.17,7.39 J1.3
  Bottom 0.254: v24.57,20.03 24.57,19.41 23.31,18.14 18.76,18.14 v17.8,17.18
TXD0  (via drill 0.6)
  Top 0.254: IC5.30 11.6,28.02 v11.45,28.16 | v37.17,4.4 35.97,4.4 R11.2
  Bottom 0.203: v37.17,4.4 37.29,4.47 37.18,4.45
  Bottom 0.254: 37.18,4.45 36.29,4.45 34.71,2.87 15.16,2.87 13.15,4.88 11.43,4.88 9.64,6.83 9.64,7.94 9.72,8.51 9.72,15.7 10.24,16.22 10.24,18.93 9.84,19.8 9.84,23.5 10.39,24.02 10.39,26.67 11.47,27.74 11.47,28.21 v11.45,28.16
TXD0B
  Top 0.254: J1.12 28.19,8.64 29.32,7.53 29.32,5.38 30.11,4.59 32.17,4.59 32.44,4.32 34.07,4.32 R11.1
VCC  (via drill 0.6)
  Top 0.203: 15.75,46.74 U1.18 | 15.75,47.14 U1.19 | C5.1 19.81,45.11 19.81,45.52 18.39,46.94 C13.2 18.19,47.14 | 18.19,48.77 C12.2 18.39,48.97 | v12.45,58.88 12.5,58.93 11.23,59.64 10.97,63.2 v11.08,63.44 | 25.09,59.13 v25.09,59.22 | 29.36,56.9 v29.42,56.75
  Top 0.254: IC5.4 6.72,22.05 6.31,22.46 | 6.31,22.46 5.4,23.37 2.02,23.37 v1.48,25.67 | IC5.6 7.62,20.45 7.06,21.02 6.31,21.02 6.31,22.46 | 10.81,11.78 R2.2 | 6.51,11.69 v6.51,11.78 | 14.4,11.98 R7.2 | D2.2 | 10.29,35.41 C1.1 | C1.1 10.31,35.17 | 12.06,35.64 11.9,35.45 | 10.29,35.45 10.29,35.19 C1.1 | C2.1 8.72,39.64 7.8,38.73 IC1.5 | 18.77,38.16 v18.86,38.25 | v30.72,40.06 30.72,40.02
  Top 0.305: U1.19 U1.20
  Top 0.362: 15.75,47.14 15.75,46.74
  Top 0.4: IC2.5 9.24,34.36 10.29,35.41
  Top 0.5: R7.2 14.32,11.55 15.25,10.63 15.24,8.89 J1.2 14.58,8.64 14.06,9.16 C7.1 11.43,9.18 10.87,9.77 R2.2 | R22.1 v21.36,11.98 | v6.51,11.78 10.81,11.78 | v15.98,11.98 14.4,11.98 | v32.25,10.12 32.88,10.12 34.96,8.35 34.96,8.06 D3.2 36.51,8.06 36.58,7.94 R8.2 | v1.48,25.67 1.48,30.63 5.49,31.31 C6.1 R9.1 | R9.1 R5.2 R6.2 C9.1 17.31,31.33 18.06,32.05 18.57,32.05 v18.85,32.17 19.41,32.12 D2.2 | D2.2 v21.44,31.1 | 10.31,35.17 11.24,34.24 11.24,31.75 R9.1 | D1.2 12.06,35.64 | 11.9,35.45 10.29,35.45 10.29,38.53 9.18,39.64 C2.1 | C8.1 29.71,53.98 F1.A 29.71,56.52 29.47,56.75 v29.42,56.75 | D5.A 11.75,64.66 12.06,64.35 11.15,63.44 v11.08,63.44 | v24.36,28.25 26.14,28.25 26.14,31.5 31.63,31.5 31.63,31.05 v31.67,28.25 31.77,32.79 31.7,39.04 30.72,40.02 | R13.2 18.77,38.16 | 15.75,47.14 18.19,47.14 18.19,48.77 | 18.39,48.97 18.39,53.85 19.61,55.07 v19.68,55.08 | 25.09,59.13 27.13,59.13 29.36,56.9
  Bottom 0.254: 1.48,21.8 1.48,21.86 | 24.36,29.16 24.34,29.16 | v12.45,58.88 12.42,59.05
  Bottom 0.406: 31.67,12.06 31.67,12.41
  Bottom 0.5: U$2.A 11.48,66.78 D5.A | VR1.3 11.69,64.02 v11.08,63.44 | v1.48,25.67 1.48,21.86 | v6.51,11.78 6.58,11.94 6.58,15.11 1.46,15.11 1.48,21.8 | v15.98,11.98 v21.36,11.98 | v32.25,10.12 31.67,10.79 31.67,12.41 v31.67,28.25 | v24.36,28.25 24.36,29.16 | v21.44,31.1 22.4,31.1 24.34,29.16 | v29.42,56.75 29.29,56.62 29.29,41.48 v30.72,40.06 | v25.09,59.22 24.49,59.22 20.35,55.08 v19.68,55.08 v15.76,55.08 14.13,55.08 12.45,56.76 v12.45,58.88 | v18.86,38.25 v18.85,32.17 | J4.1 31.67,12.06
(copper drawn outside any net)
  shapes: Top area x4

### Text on the board
tNames: IC2